# Altium schematic sheet RS232.SchDoc
size A; SheetNumber: 5; SheetTotal: 5
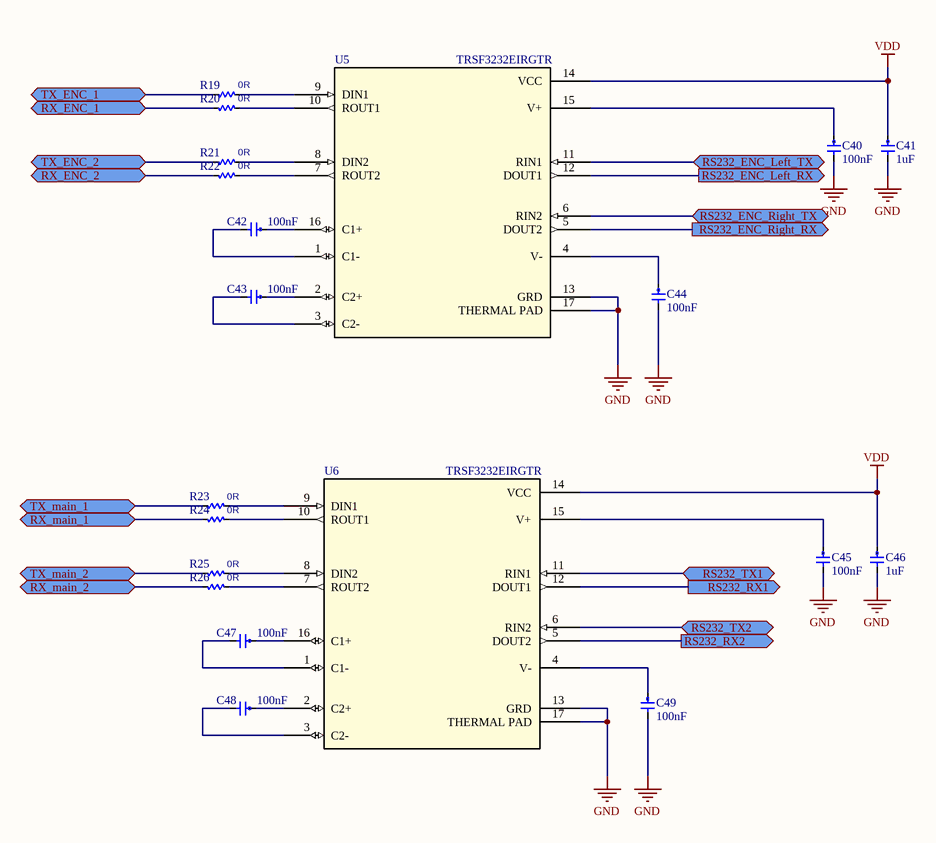
[diagram p0: RS232.SchDoc]

## Parts
C40  Capacitance: 100nF  [CAP0402]  (hidden comment: GRM155R71H104KE14D)
C41  Capacitance: 1uF  [CAP0402]  (hidden comment: CC0402KRX5R8BB105)
C42  Capacitance: 100nF  [CAP0402]  (hidden comment: GRM155R71H104KE14D)
C43  Capacitance: 100nF  [CAP0402]  (hidden comment: GRM155R71H104KE14D)
C44  Capacitance: 100nF  [CAP0402]  (hidden comment: GRM155R71H104KE14D)
C45  Capacitance: 100nF  [CAP0402]  (hidden comment: GRM155R71H104KE14D)
C46  Capacitance: 1uF  [CAP0402]  (hidden comment: CC0402KRX5R8BB105)
C47  Capacitance: 100nF  [CAP0402]  (hidden comment: GRM155R71H104KE14D)
C48  Capacitance: 100nF  [CAP0402]  (hidden comment: GRM155R71H104KE14D)
C49  Capacitance: 100nF  [CAP0402]  (hidden comment: GRM155R71H104KE14D)
R19  value 0R  [RES0402]  (hidden comment: RES0402)
R20  value 0R  [RES0402]  (hidden comment: RES0402)
R21  value 0R  [RES0402]  (hidden comment: RES0402)
R22  value 0R  [RES0402]  (hidden comment: RES0402)
R23  value 0R  [RES0402]  (hidden comment: RES0402)
R24  value 0R  [RES0402]  (hidden comment: RES0402)
R25  value 0R  [RES0402]  (hidden comment: RES0402)
R26  value 0R  [RES0402]  (hidden comment: RES0402)
U5  TRSF3232EIRGTR  [VQFN_2EIRGTR_TEX]
U6  TRSF3232EIRGTR  [VQFN_2EIRGTR_TEX]

## Ports
RS232_ENC_Left_RX (out), RS232_ENC_Left_TX (bidir), RS232_ENC_Right_RX (out), RS232_ENC_Right_TX (bidir), RS232_RX1 (out), RS232_RX2 (out), RS232_TX1 (bidir), RS232_TX2 (bidir), RX_ENC_1 (bidir), RX_ENC_2 (bidir), RX_main_1 (bidir), RX_main_2 (bidir), TX_ENC_1 (bidir), TX_ENC_2 (bidir), TX_main_1 (bidir), TX_main_2 (bidir)

## Nets
GND: C40.2 C41.2 C44.2 C45.2 C46.2 C49.2 U5.13(GRD) U5.17(THERMAL_PAD) U6.13(GRD) U6.17(THERMAL_PAD)
VDD: C41.1 C46.1 U5.14(VCC) U6.14(VCC)
RS232_ENC_Left_RX: U5.12(DOUT1) ; port RS232_ENC_Left_RX
RS232_ENC_Left_TX: U5.11(RIN1) ; port RS232_ENC_Left_TX
RS232_ENC_Right_RX: U5.5(DOUT2) ; port RS232_ENC_Right_RX
RS232_ENC_Right_TX: U5.6(RIN2) ; port RS232_ENC_Right_TX
RS232_RX1: U6.12(DOUT1) ; port RS232_RX1
RS232_RX2: U6.5(DOUT2) ; port RS232_RX2
RS232_TX1: U6.11(RIN1) ; port RS232_TX1
RS232_TX2: U6.6(RIN2) ; port RS232_TX2
RX_ENC_1: R20.1 ; port RX_ENC_1
RX_ENC_2: R22.1 ; port RX_ENC_2
RX_main_1: R24.1 ; port RX_main_1
RX_main_2: R26.1 ; port RX_main_2
TX_ENC_1: R19.1 ; port TX_ENC_1
TX_ENC_2: R21.1 ; port TX_ENC_2
TX_main_1: R23.1 ; port TX_main_1
TX_main_2: R25.1 ; port TX_main_2
NetC40_1: C40.1 U5.15(V+)
NetC42_1: C42.1 U5.16(C1+)
NetC42_2: C42.2 U5.1(C1-)
NetC43_1: C43.1 U5.2(C2+)
NetC43_2: C43.2 U5.3(C2-)
NetC44_1: C44.1 U5.4(V-)
NetC45_1: C45.1 U6.15(V+)
NetC47_1: C47.1 U6.16(C1+)
NetC47_2: C47.2 U6.1(C1-)
NetC48_1: C48.1 U6.2(C2+)
NetC48_2: C48.2 U6.3(C2-)
NetC49_1: C49.1 U6.4(V-)
NetR19_2: R19.2 U5.9(DIN1)
NetR20_2: R20.2 U5.10(ROUT1)
NetR21_2: R21.2 U5.8(DIN2)
NetR22_2: R22.2 U5.7(ROUT2)
NetR23_2: R23.2 U6.9(DIN1)
NetR24_2: R24.2 U6.10(ROUT1)
NetR25_2: R25.2 U6.8(DIN2)
NetR26_2: R26.2 U6.7(ROUT2)

## Library data of the parts
C40 C42-C45 C47-C49 = CMP-01036-1: CAP CER 0.1UF 50V X7R 0402; Manufacturer 1: Murata Electronics; Dielectric Material: Ceramic; Tolerance: 10%; Dissipation Factor: 0.025%; Termination: SMD/SMT; Voltage Rating: 50V; Composition: Ceramic; Max Operating Temperature: 125°C; REACH SVHC: No SVHC; Case/Package: 0402; Case Code (Imperial): 0402; Material: Ceramic; Manufacturer Part Number 1: GRM155R71H104KE14D; Weight: 0.000212oz; Width: 0.5mm; Package Quantity: 10000; Packaging: Tape and Reel; Mount: Surface Mount; Voltage Rating (DC): 50V; Dielectric: X7R; Depth: 0.5mm; Case Code (Metric): 1005; Length: 1mm; Height: 0.5mm; Min Operating Temperature: -55°C; Thickness: 0.022inch; Lead Free: Lead Free; Voltage: 50V
C41 C46 = CMP-00520-1: CAP CER 1UF 25V X5R 0402; Manufacturer 1: TDK Corporation; Tolerance: 10%; Case Code (Imperial): 0402; Case/Package: 0402; Voltage: 25V; Min Operating Temperature: -55°C; Termination: SMD/SMT; Voltage Rating: 25V; Length: 1mm; REACH SVHC: No SVHC; Max Operating Temperature: 85°C; Radiation Hardening: No; Depth: 0.5mm; Case Code (Metric): 1005; Dielectric: X5R; Manufacturer Part Number 1: CC0402KRX5R8BB105; Packaging: Tape and Reel
R19-R26 = RES0402: RES 0402; MP: add later
U5 U6 = TRSF3232EIRGTR: No Description Available; Mfr_Name: Texas Instruments; RefDes: RefDes; Type: Type